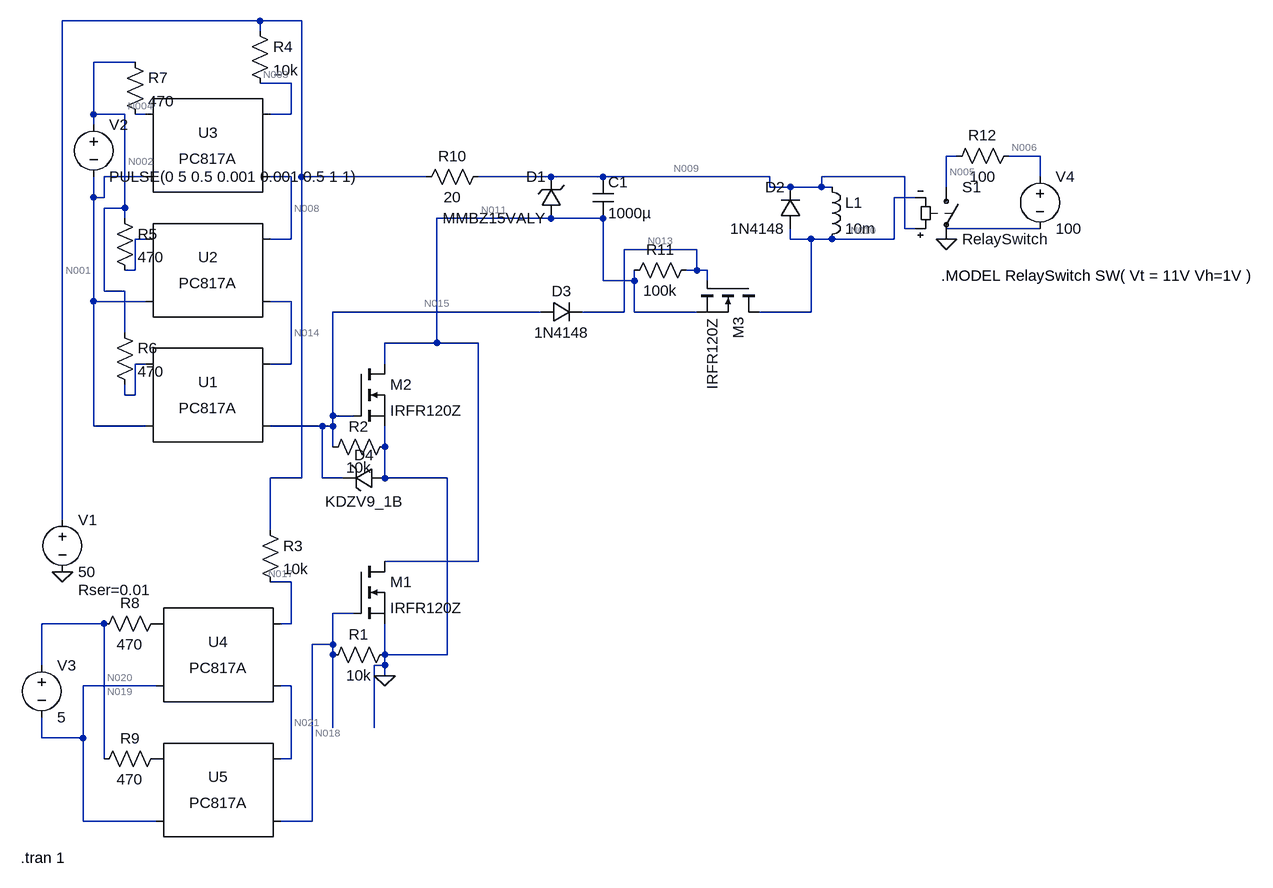
[diagram p0: schematic Chg_DSCHG_Controller.asc]
Chg_DSCHG_Controller.asc, the LTspice schematic file:
Version 4
SHEET 1 2004 680
WIRE 448 -640 144 -640
WIRE 512 -640 448 -640
WIRE 448 -624 448 -640
WIRE 256 -576 192 -576
WIRE 496 -544 448 -544
WIRE 192 -496 192 -576
WIRE 240 -496 192 -496
WIRE 272 -496 256 -496
WIRE 496 -496 496 -544
WIRE 496 -496 464 -496
WIRE 192 -480 192 -496
WIRE 1520 -432 1504 -432
WIRE 1648 -432 1600 -432
WIRE 272 -400 208 -400
WIRE 496 -400 464 -400
WIRE 512 -400 512 -640
WIRE 704 -400 512 -400
WIRE 896 -400 784 -400
WIRE 976 -400 896 -400
WIRE 1232 -400 976 -400
WIRE 1440 -400 1312 -400
WIRE 1648 -400 1648 -432
WIRE 1232 -384 1232 -400
WIRE 1264 -384 1232 -384
WIRE 1312 -384 1312 -400
WIRE 1312 -384 1264 -384
WIRE 1328 -384 1312 -384
WIRE 1504 -384 1504 -432
WIRE 192 -368 192 -400
WIRE 208 -368 208 -400
WIRE 208 -368 192 -368
WIRE 1456 -368 1424 -368
WIRE 240 -352 240 -496
WIRE 240 -352 208 -352
WIRE 240 -336 240 -352
WIRE 896 -336 720 -336
WIRE 976 -336 896 -336
WIRE 1440 -320 1440 -400
WIRE 1456 -320 1440 -320
WIRE 1648 -320 1504 -320
WIRE 272 -304 256 -304
WIRE 496 -304 496 -400
WIRE 496 -304 464 -304
WIRE 1264 -304 1264 -320
WIRE 1296 -304 1264 -304
WIRE 1328 -304 1296 -304
WIRE 1424 -304 1424 -368
WIRE 1424 -304 1328 -304
WIRE 1504 -304 1504 -320
WIRE 1120 -288 1008 -288
WIRE 256 -256 256 -304
WIRE 256 -256 240 -256
WIRE 1120 -256 1120 -288
WIRE 1120 -256 1104 -256
WIRE 1136 -256 1120 -256
WIRE 976 -240 976 -336
WIRE 1024 -240 1024 -256
WIRE 1024 -240 976 -240
WIRE 1136 -240 1136 -256
WIRE 208 -224 208 -352
WIRE 240 -224 208 -224
WIRE 192 -208 192 -368
WIRE 272 -208 192 -208
WIRE 496 -208 464 -208
WIRE 880 -192 560 -192
WIRE 1008 -192 1008 -288
WIRE 1008 -192 944 -192
WIRE 1024 -192 1024 -240
WIRE 1120 -192 1024 -192
WIRE 1296 -192 1296 -304
WIRE 1296 -192 1216 -192
WIRE 240 -160 240 -224
WIRE 720 -144 720 -336
WIRE 720 -144 640 -144
WIRE 784 -144 720 -144
WIRE 272 -112 256 -112
WIRE 496 -112 496 -208
WIRE 496 -112 464 -112
WIRE 640 -112 640 -144
WIRE 240 -64 240 -80
WIRE 256 -64 256 -112
WIRE 256 -64 240 -64
WIRE 560 -32 560 -192
WIRE 592 -32 560 -32
WIRE 192 -16 192 -208
WIRE 272 -16 192 -16
WIRE 544 -16 464 -16
WIRE 560 -16 560 -32
WIRE 560 -16 544 -16
WIRE 560 16 560 -16
WIRE 640 16 640 -16
WIRE 512 64 512 -400
WIRE 512 64 464 64
WIRE 544 64 544 -16
WIRE 576 64 544 64
WIRE 640 64 640 16
WIRE 736 64 640 64
WIRE 144 128 144 -640
WIRE 464 144 464 64
WIRE 784 192 784 -144
WIRE 784 192 640 192
WIRE 496 224 464 224
WIRE 592 272 560 272
WIRE 208 288 112 288
WIRE 496 288 496 224
WIRE 496 288 480 288
WIRE 560 320 560 272
WIRE 560 320 528 320
WIRE 560 336 560 320
WIRE 640 336 640 288
WIRE 736 336 736 64
WIRE 736 336 640 336
WIRE 112 352 112 288
WIRE 640 352 640 336
WIRE 640 352 624 352
WIRE 640 368 640 352
WIRE 288 384 176 384
WIRE 496 384 480 384
WIRE 560 448 560 336
WIRE 624 448 624 352
WIRE 112 464 112 432
WIRE 176 464 176 384
WIRE 176 464 112 464
WIRE 208 496 208 288
WIRE 496 496 496 384
WIRE 496 496 480 496
WIRE 176 592 176 464
WIRE 288 592 176 592
WIRE 528 592 528 320
WIRE 528 592 480 592
FLAG 144 208 0
FLAG 640 368 0
FLAG 1504 -304 0
SYMBOL voltage 144 112 R0
WINDOW 123 0 0 Left 0
WINDOW 39 24 124 Left 2
SYMATTR SpiceLine Rser=0.01
SYMATTR InstName V1
SYMATTR Value 50
SYMBOL nmos 592 192 R0
SYMATTR InstName M1
SYMATTR Value IRFR120Z
SYMBOL nmos 592 -112 R0
SYMATTR InstName M2
SYMATTR Value IRFR120Z
SYMBOL res 656 320 R90
WINDOW 0 0 56 VBottom 2
WINDOW 3 32 56 VTop 2
SYMATTR InstName R1
SYMATTR Value 10k
SYMBOL res 656 0 R90
WINDOW 0 0 56 VBottom 2
WINDOW 3 32 56 VTop 2
SYMATTR InstName R2
SYMATTR Value 10k
SYMBOL Optos\\PC817A 368 -64 R0
SYMATTR InstName U1
SYMBOL Optos\\PC817A 368 -256 R0
SYMATTR InstName U2
SYMBOL Optos\\PC817A 368 -448 R0
SYMATTR InstName U3
SYMBOL Optos\\PC817A 384 336 R0
SYMATTR InstName U4
SYMBOL Optos\\PC817A 384 544 R0
SYMATTR InstName U5
SYMBOL res 448 128 R0
SYMATTR InstName R3
SYMATTR Value 10k
SYMBOL res 432 -640 R0
SYMATTR InstName R4
SYMATTR Value 10k
SYMBOL voltage 192 -496 R0
WINDOW 123 0 0 Left 0
WINDOW 39 0 0 Left 0
SYMATTR InstName V2
SYMATTR Value PULSE(0 5 0.5 0.001 0.001 0.5 1 1)
SYMBOL res 224 -352 R0
SYMATTR InstName R5
SYMATTR Value 470
SYMBOL res 224 -176 R0
SYMATTR InstName R6
SYMATTR Value 470
SYMBOL res 240 -592 R0
SYMATTR InstName R7
SYMATTR Value 470
SYMBOL voltage 112 336 R0
WINDOW 123 0 0 Left 0
WINDOW 39 0 0 Left 0
SYMATTR InstName V3
SYMATTR Value 5
SYMBOL res 304 272 R90
WINDOW 0 0 56 VBottom 2
WINDOW 3 32 56 VTop 2
SYMATTR InstName R8
SYMATTR Value 470
SYMBOL res 304 480 R90
WINDOW 0 0 56 VBottom 2
WINDOW 3 32 56 VTop 2
SYMATTR InstName R9
SYMATTR Value 470
SYMBOL zener 912 -336 R180
WINDOW 0 24 64 Left 2
WINDOW 3 24 0 Left 2
SYMATTR InstName D1
SYMATTR Value MMBZ15VALY
SYMBOL res 800 -416 R90
WINDOW 0 0 56 VBottom 2
WINDOW 3 32 56 VTop 2
SYMATTR InstName R10
SYMATTR Value 20
SYMBOL cap 960 -400 R0
SYMATTR InstName C1
SYMATTR Value 1000µ
SYMBOL ind 1312 -400 R0
SYMATTR InstName L1
SYMATTR Value 10m
SYMATTR SpiceLine Ipk=0.01 Rser=200
SYMBOL diode 1280 -320 R180
WINDOW 0 24 64 Left 2
WINDOW 3 24 0 Left 2
SYMATTR InstName D2
SYMATTR Value 1N4148
SYMBOL nmos 1216 -240 R90
SYMATTR InstName M3
SYMATTR Value IRFR120Z
SYMBOL res 1120 -272 R90
WINDOW 0 0 56 VBottom 2
WINDOW 3 32 56 VTop 2
SYMATTR InstName R11
SYMATTR Value 100k
SYMBOL diode 880 -176 R270
WINDOW 0 32 32 VTop 2
WINDOW 3 0 32 VBottom 2
SYMATTR InstName D3
SYMATTR Value 1N4148
SYMBOL sw 1504 -400 R0
SYMATTR InstName S1
SYMATTR Value RelaySwitch
SYMBOL res 1616 -448 R90
WINDOW 0 0 56 VBottom 2
WINDOW 3 32 56 VTop 2
SYMATTR InstName R12
SYMATTR Value 100
SYMBOL voltage 1648 -416 R0
WINDOW 123 0 0 Left 0
WINDOW 39 0 0 Left 0
SYMATTR InstName V4
SYMATTR Value 100
SYMBOL zener 640 48 R90
WINDOW 0 -4 32 VBottom 2
WINDOW 3 36 32 VTop 2
SYMATTR InstName D4
SYMATTR Value KDZV9_1B
TEXT 80 648 Left 2 !.tran 1
TEXT 1496 -248 Left 2 !.MODEL RelaySwitch SW( Vt = 11V Vh=1V )

The netlist it stands for:
* Chg_DSCHG_Controller.asc
V1 N001 0 50 Rser=0.01
M1 N011 N018 0 0 IRFR120Z
M2 N011 N015 0 0 IRFR120Z
R1 0 N018 10k
R2 0 N015 10k
XU1 N016 N007 N014 N015 PC817 Igain=1m
XU2 N012 N007 N008 N014 PC817 Igain=1m
XU3 N004 N007 N003 N008 PC817 Igain=1m
XU4 P001 N020 N017 N021 PC817 Igain=1m
XU5 P002 N020 N021 N018 PC817 Igain=1m
R3 N001 N017 10k
R4 N001 N003 10k
V2 N002 N007 PULSE(0 5 0.5 0.001 0.001 0.5 1 1)
R5 N002 N012 470
R6 N002 N016 470
R7 N002 N004 470
V3 N019 N020 5
R8 P001 N019 470
R9 P002 N019 470
D1 N011 N009 MMBZ15VALY
R10 N009 N001 20
C1 N009 N011 1000µ
L1 N009 N010 10m Ipk=0.01 Rser=200
D2 N010 N009 1N4148
M3 N010 N013 N011 N011 IRFR120Z
R11 N013 N011 100k
D3 N015 N013 1N4148
S1 N005 0 N009 N010 RelaySwitch
R12 N006 N005 100
V4 N006 0 100
D4 0 N015 KDZV9_1B
.model D D
.lib standard.dio
.model NMOS NMOS
.model PMOS PMOS
.lib standard.mos
.tran 1
.MODEL RelaySwitch SW( Vt = 11V Vh=1V )
.lib PC817.sub
.backanno
.end

* Results of the author's LTspice run, read from the files saved beside the schematic
* Operating Point, zero values left out:
*   V(n001) = 49.98 V
*   V(n011) = 134.8 mV
*   V(n018) = 24.85 V
*   V(n015) = 24.67 µV
*   V(n014) = 16.66 V
*   V(n008) = 33.32 V
*   V(n003) = 49.98 V
*   V(n020) = -5 V
*   V(p001) = -3.916 V
*   V(n017) = 25.13 V
*   V(n021) = 24.99 V
*   V(p002) = -3.916 V
*   V(n019) = -216.8 nV
*   V(n009) = 15.17 V
*   V(n010) = 15.17 V
*   V(n013) = 134.6 mV
*   V(n005) = 100 V
*   V(n006) = 100 V
*   Id(M3) = 15.23 pA
*   Is(M3) = -15.23 pA
*   Id(M1) = 1.741 A
*   Is(M1) = -1.741 A
*   I(D3) = -2.391 nA
*   I(D1) = -1.741 A
*   I(L1) = 30.26 pA
*   I(R12) = 200 pA
*   I(R11) = -2.391 nA
*   I(R10) = -1.741 A
*   I(R9) = -8.332 mA
*   I(R8) = -8.332 mA
*   I(R4) = 76.34 pA
*   I(R3) = 2.485 mA
*   I(R2) = -2.467 nA
*   I(R1) = -2.485 mA
*   I(S1) = -200 pA
*   I(V4) = -200 pA
*   I(V3) = -16.66 mA
*   I(V1) = -1.743 A
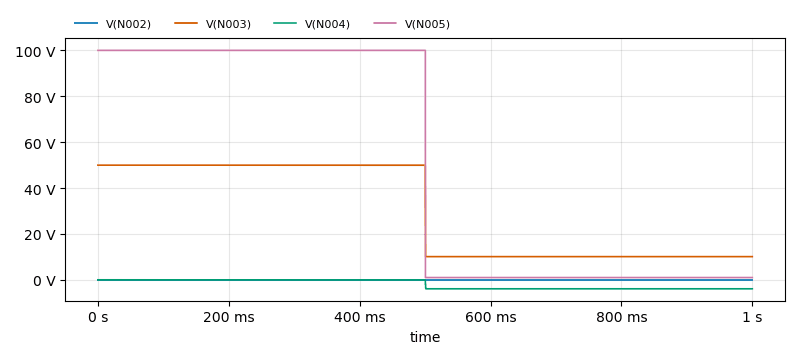
[diagram p1: Transient Analysis of Chg_DSCHG_Controller.asc, plotted from the saved traces]
* Transient Analysis, 1 run:
*   V(N002): min -1.506 µV, max 875.6 nV, average -562 nV, rms 801.9 nV, last -264.7 nV
*   V(N003): min 10.1 V, max 49.98 V, average 30.06 V, rms 36.07 V, last 10.1 V
*   V(N004): min -3.916 V, max 0 V, average -1.956 V, rms 2.767 V, last -3.916 V
*   V(N005): min 990.1 mV, max 100 V, average 50.53 V, rms 70.74 V, last 990.1 mV